# EasyEDA Pro project ProPrj_Project_PRISM_2026-03-07.epro, board PRISM RP2040 260307
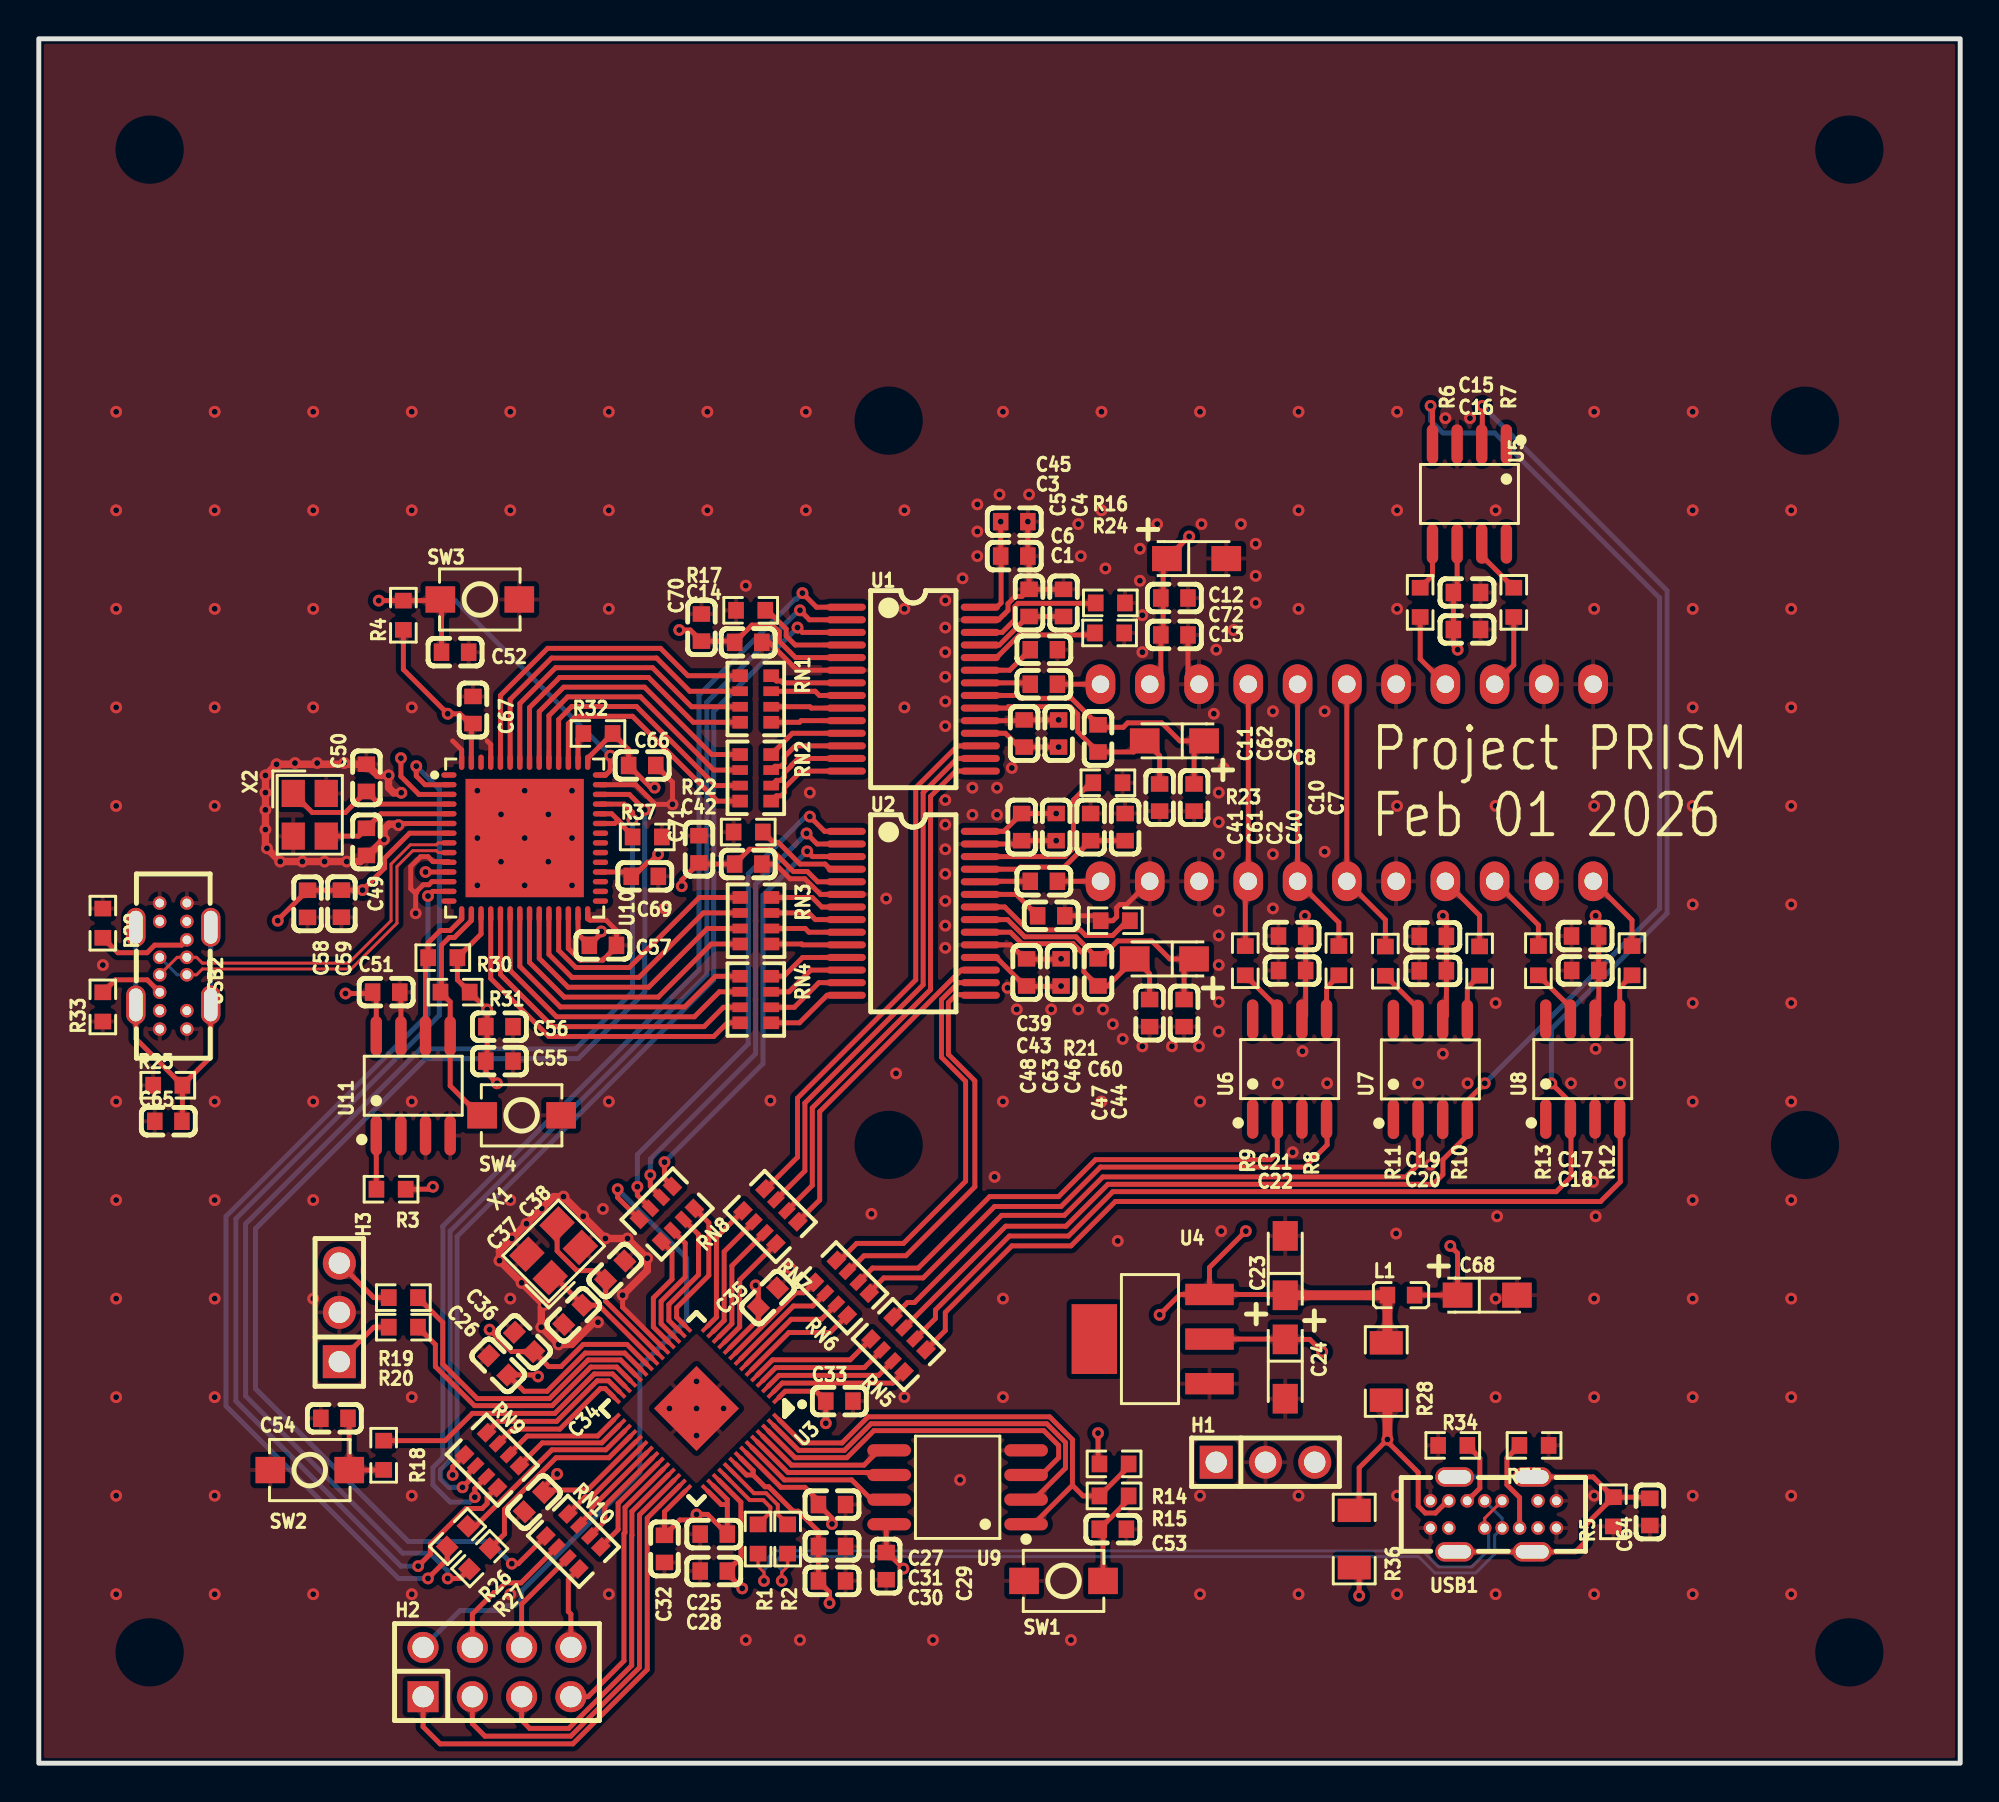
[diagram p4: board, top side]
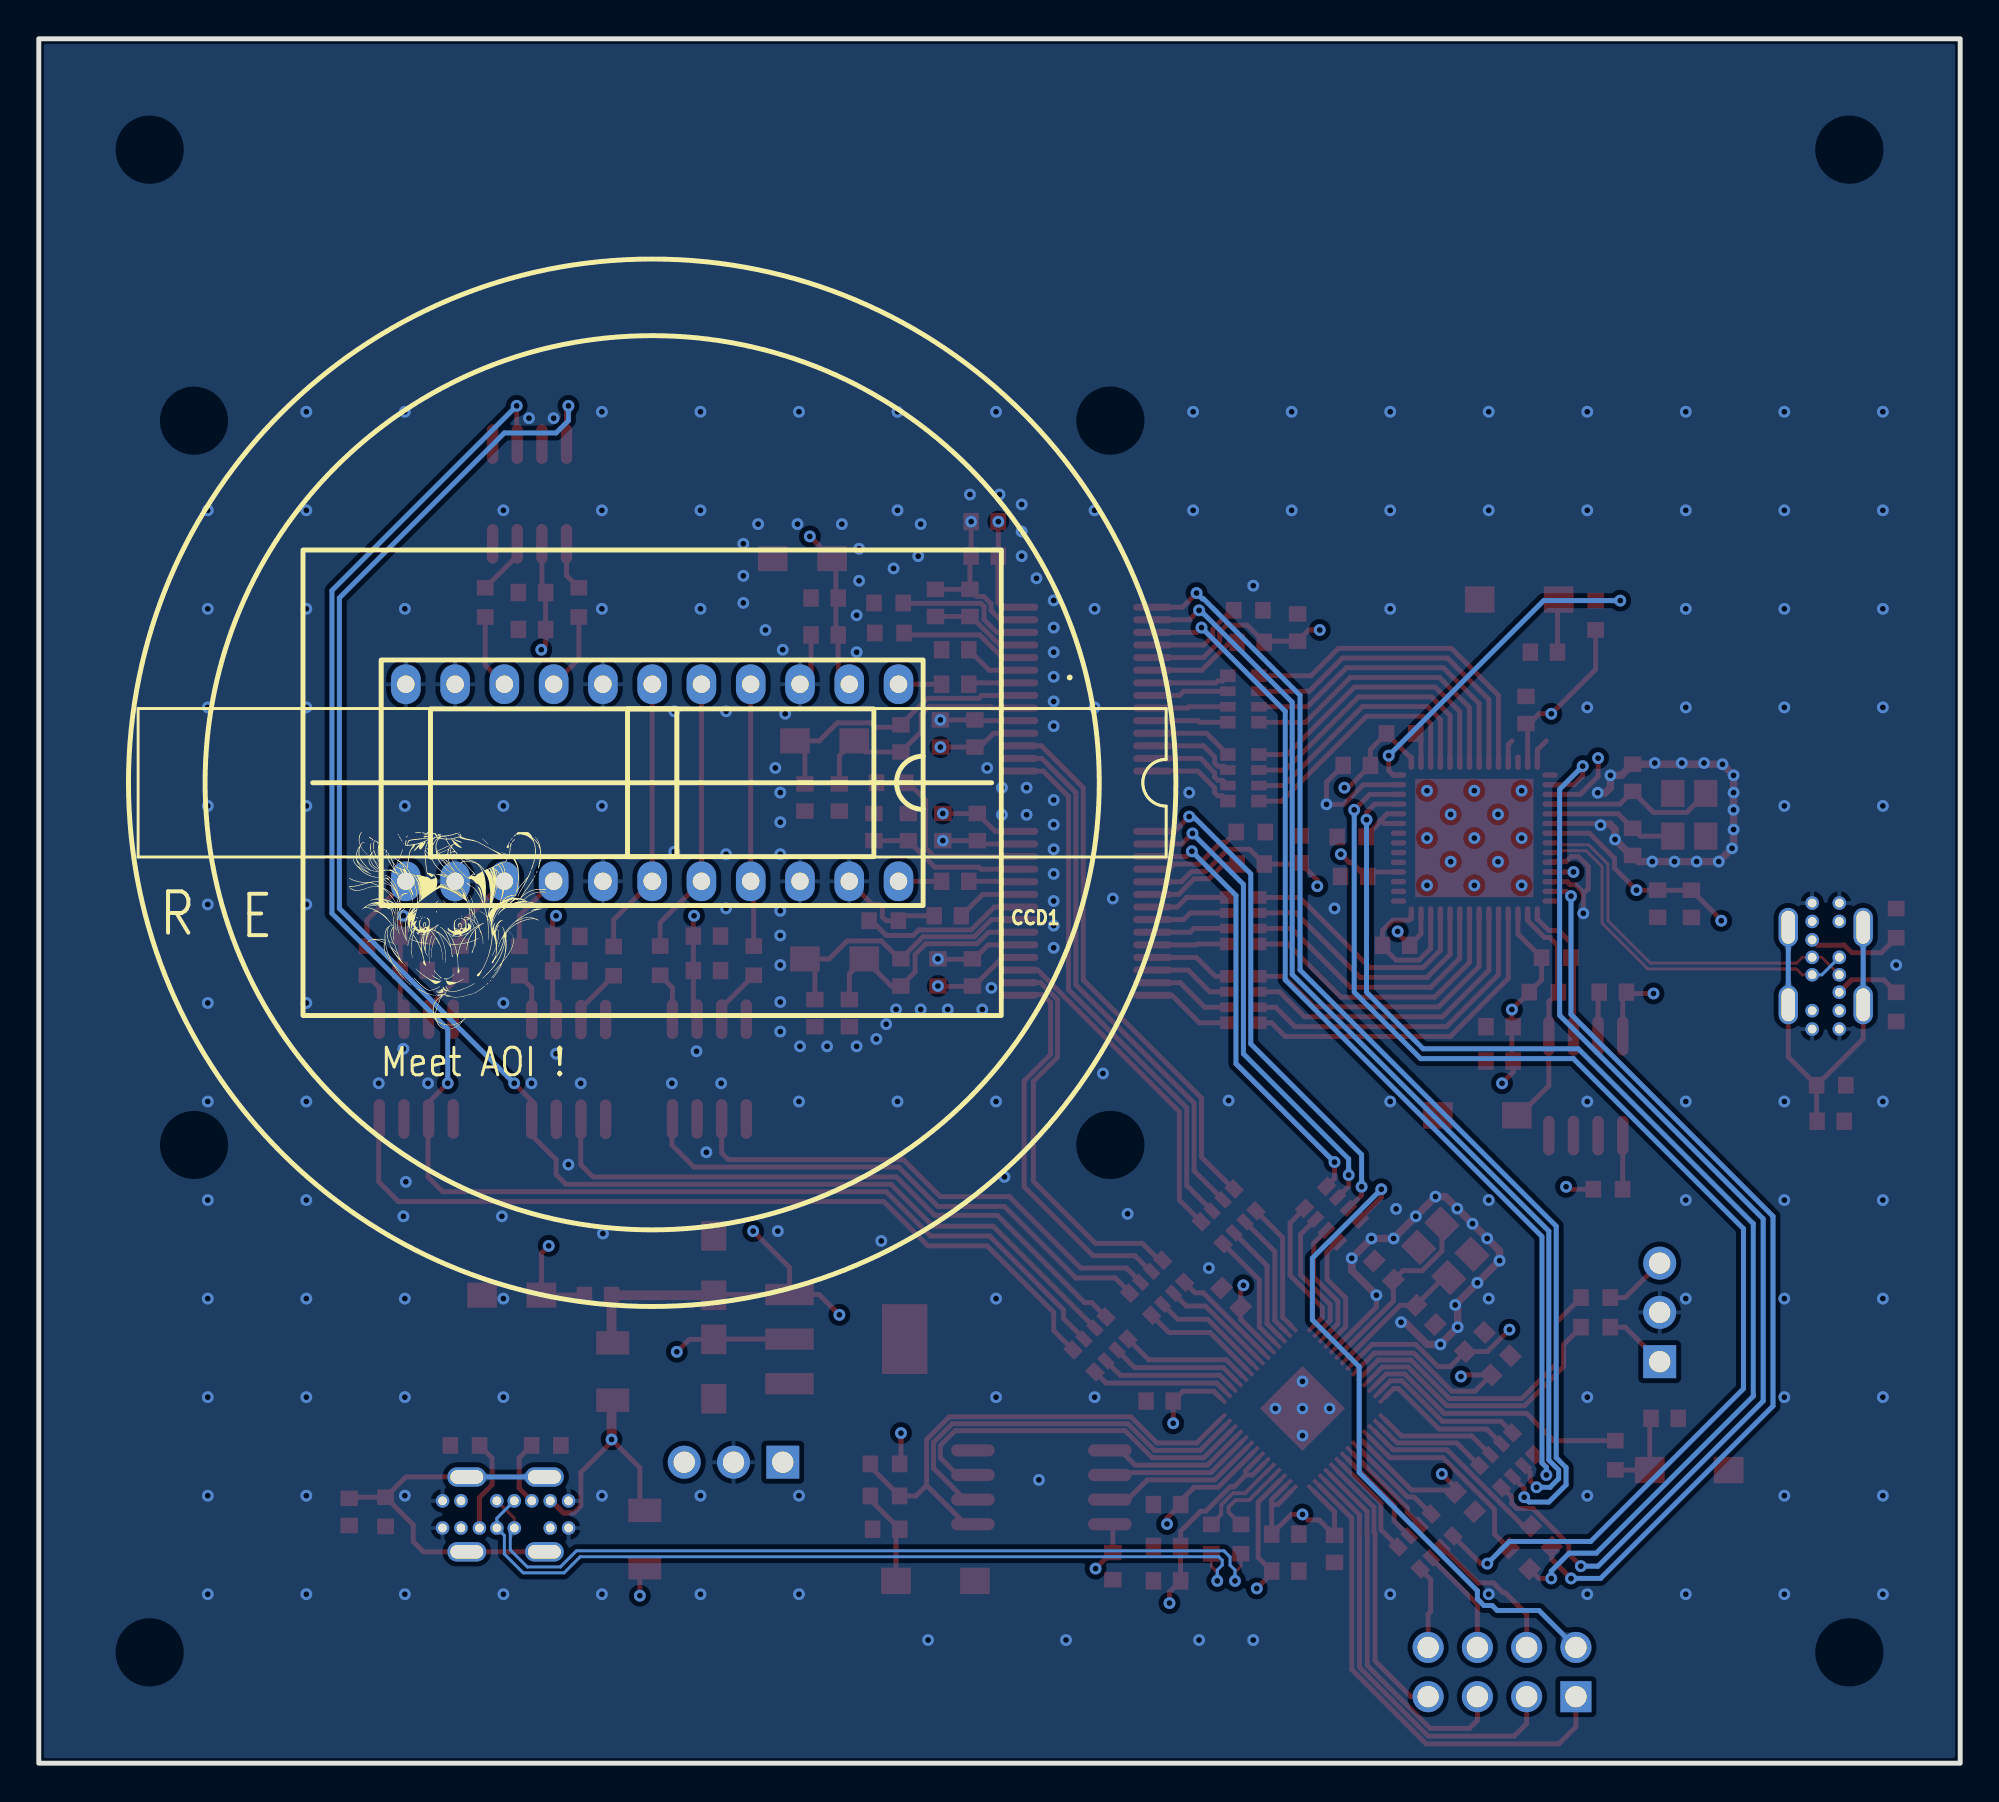
[diagram p5: board, bottom side, seen from below]

Outline 99.06 x 88.9 mm; copper layers: Top Layer, Inner1, Inner2, Bottom Layer. Coordinates in mm from the lower left corner of the outline.
Outline path: rectangle 0,88.9 99.06,0
Stack: Top Layer 0.035mm Outer layer thickness 1oz / Dielectric1 0.2104mm 7628 RC49% 8.6mil / Inner1 0.0152mm Inner layer thickness / Dielectric2 1.065mm 1.1mm H/HOZ Copper / Inner2 0.0152mm Inner layer thickness / Dielectric3 0.2104mm 7628 RC49% 8.6mil / Bottom Layer 0.035mm Outer layer thickness 1oz

## Design rules (mm)
net $2N75: RPI_USB_R
net $2N73: RPI_USB_R
net RPI_USB_DM: RPI_USB
net RPI_USB_DP: RPI_USB
net FIFO_USB_DP: FIFO_USB
net FIFO_USB_DM: FIFO_USB
spacing copperThickness1oz (default): track to track 0.102, other pairs 0.152 to 0.3
spacing copperThickness2oz: track to track 0.203, other pairs 0.152 to 0.3
track width copperThickness1oz (default): min 0.127, default 0.254, max 2.54
track width copperThickness2oz: min 0.203, default 0.254, max 2.54
differential pair differentialPair (default): width min 0.127, default 0.254, max 2.54; gap min 0.152, default 0.152

## Placement (name value [footprint] x y rotation side)
C1  100nF  [C0603]  51.82 55.63 0 top
C2  100nF  [C0603]  54.23 48.26 270 top
C3  100nF  [C0603]  50.29 62.23 180 top
C4  100nF  [C0603]  52.83 59.82 270 top
C5  1uF  [C0603]  51.05 59.82 270 top
C6  100nF  [C0603]  51.82 57.4 0 top
C7  100nF  [C0603]  59.56 49.78 270 top
C8  10uF  [CAP-SMD_L3.2-W1.6-RD-C7171]  58.55 52.71 180 top
C9  100nF  [C0603]  54.61 52.83 90 top
C10  100nF  [C0603]  57.78 49.78 270 top
C11  100nF  [C0603]  50.8 53.09 90 top
C12  10uF  [CAP-SMD_L3.2-W1.6-RD-C7171]  59.69 62.1 0 top
C13  100nF  [C0603]  58.55 58.17 180 top
C14  100nF  [C0603]  36.58 57.79 180 top
C15  1uF  [C0603]  73.63 58.45 180 top
C16  100nF  [C0603]  73.63 60.35 180 top
C17  1uF  [C0603]  79.72 42.64 0 top
C18  100nF  [C0603]  79.73 40.87 0 top
C19  1uF  [C0603]  71.87 42.63 0 top
C20  100nF  [C0603]  71.87 40.85 0 top
C21  1uF  [C0603]  64.61 42.64 0 top
C22  100nF  [C0603]  64.61 40.87 0 top
C23  10uF  [CAP-SMD_L3.2-W1.6-RD-C7171]  64.26 25.65 90 top
C24  10uF  [CAP-SMD_L3.2-W1.6-RD-C7171]  64.26 20.32 270 top
C25  1uF  [C0603]  34.8 11.81 180 top
C26  100nF  [C0603]  23.69 20.51 135 top
C27  100nF  [C0603]  40.89 13.34 0 top
C28  1uF  [C0603]  34.8 9.91 180 top
C29  100nF  [C0603]  43.69 10.16 270 top
C30  100nF  [C0603]  40.89 9.4 0 top
C31  100nF  [C0603]  40.89 11.18 0 top
C32  100nF  [C0603]  32.26 11.05 270 top
C33  100nF  [C0603]  41.28 18.67 0 top
C34  100nF  [C0603]  25.53 13.46 225 top
C35  100nF  [C0603]  37.59 24 45 top
C36  100nF  [C0603]  25.02 21.72 135 top
C37  12pF  [C0603]  27.56 23.11 45 top
C38  12pF  [C0603]  29.72 25.4 225 top
C39  100nF  [C0603]  51.82 45.47 0 top
C40  1uF  [C0603]  56.01 48.26 270 top
C41  100nF  [C0603]  50.67 48.26 90 top
C42  100nF  [C0603]  36.58 46.36 180 top
C43  100nF  [C0603]  52.2 43.69 0 top
C44  100nF  [C0603]  59.05 38.67 270 top
C45  1uF  [C0603]  50.29 64.01 180 top
C46  100nF  [C0603]  54.61 40.77 90 top
C47  100nF  [C0603]  57.27 38.67 270 top
C48  100nF  [C0603]  50.93 40.77 90 top
C49  12pF  [C0603]  16.89 47.5 90 top
C50  12pF  [C0603]  16.89 50.8 270 top
C51  100nF  [C0603]  17.91 39.75 180 top
C52  1uF  [C0603]  21.46 57.28 0 top
C53  1uF  [C0603]  55.37 12.06 180 top
C54  DNF  [C0603]  15.24 17.78 0 top
C55  1uF  [C0603]  23.75 36.2 180 top
C56  100nF  [C0603]  23.75 37.97 180 top
C57  100nF  [C0603]  29.08 42.16 180 top
C58  2.2uF  [C0603]  13.85 44.3 270 top
C59  100nF  [C0603]  15.6 44.31 270 top
C60  10uF  [CAP-SMD_L3.2-W1.6-RD-C7171]  58.03 41.46 180 top
C61  1uF  [C0603]  52.45 48.26 90 top
C62  1uF  [C0603]  52.58 53.09 90 top
C63  1uF  [C0603]  52.71 40.77 90 top
C64  100nF  [C0603]  83.06 12.95 270 top
C65  100nF  [C0603]  6.68 33.09 180 top
C66  100nF  [C0603]  31.11 51.44 180 top
C67  100nF  [C0603]  22.39 54.3 270 top
C68  10uF  [CAP-SMD_L3.2-W1.6-RD-C7171]  74.68 24.13 0 top
C69  100nF  [C0603]  31.24 45.72 180 top
C70  1uF  [C0603]  34.16 58.55 270 top
C71  1uF  [C0603]  34.04 47.12 270 top
C72  1uF  [C0603]  58.55 60.07 180 top
CCD1  -  [CDIP-22_L53.0-W9.7-P2.54-LS10.2-BL]  67.44 50.55 0 bottom
H1  -  [HDR-TH_3P-P2.54-V-M]  63.24 15.52 0 top
H2  -  [HDR-TH_8P-P2.54-V-F-R2-C4-S2.54-1]  23.62 4.7 0 top
H3  -  [HDR-TH_3P-P2.54-V-M]  15.49 23.24 90 top
L1  BLM18PG121SN1D  [L0603]  70.23 24.13 0 top
R1  27R  [R0603]  37.08 11.56 270 top
R2  27R  [R0603]  38.61 11.56 270 top
R3  10K  [R0603]  18.16 29.59 180 top
R4  10K  [R0603]  18.8 59.18 90 top
R5  10K  [R0603]  81.18 12.96 270 top
R6  27R  [R0603]  71.22 59.85 90 top
R7  27R  [R0603]  76.04 59.85 90 top
R8  47R  [R0603]  67.03 41.37 270 top
R9  47R  [R0603]  62.2 41.37 270 top
R10  27R  [R0603]  74.28 41.36 270 top
R11  47R  [R0603]  69.42 41.35 270 top
R12  47R  [R0603]  82.14 41.37 270 top
R13  27R  [R0603]  77.31 41.37 270 top
R14  DNF  [R0603]  55.44 15.43 180 top
R15  10K  [R0603]  55.44 13.78 180 top
R16  0R  [R0603]  55.25 59.82 180 top
R17  0R  [R0603]  36.7 59.44 180 top
R18  10K  [R0603]  17.78 15.88 90 top
R19  100R  [R0603]  18.8 24 0 top
R20  100R  [R0603]  18.8 22.48 0 top
R21  0R  [R0603]  55.5 43.43 0 top
R22  0R  [R0603]  36.58 48.01 180 top
R23  0R  [R0603]  55.12 50.55 180 top
R24  0R  [R0603]  55.21 58.27 180 top
R25  10K  [R0603]  6.65 34.95 180 top
R26  27R  [R0603]  21.59 11.68 225 top
R27  27R  [R0603]  22.73 10.54 225 top
R28  0R  [R1206]  69.47 20.19 90 top
R29  5.1K  [R0603]  3.3 43.31 90 top
R30  2.2K  [R0603]  20.83 41.53 0 top
R31  2.2K  [R0603]  21.46 39.75 0 top
R32  10K  [R0603]  28.83 53.09 180 top
R33  5.1K  [R0603]  3.3 38.99 90 top
R34  5.1K  [R0603]  72.9 16.38 180 top
R35  5.1K  [R0603]  77.09 16.38 0 top
R36  0R  [R1206]  67.82 11.56 270 top
R37  10K  [R0603]  31.37 47.75 0 top
RN1  27Ω  [RES-ARRAY-SMD_0603-8P-L3.2-W1.6-BL]  36.96 54.86 270 top
RN2  27Ω  [RES-ARRAY-SMD_0603-8P-L3.2-W1.6-BL]  36.96 50.8 270 top
RN3  27Ω  [RES-ARRAY-SMD_0603-8P-L3.2-W1.6-BL]  36.97 43.43 270 top
RN4  27Ω  [RES-ARRAY-SMD_0603-8P-L3.2-W1.6-BL]  36.96 39.37 270 top
RN5  27Ω  [RES-ARRAY-SMD_0603-8P-L3.2-W1.6-BL]  44.32 21.59 135 top
RN6  27Ω  [RES-ARRAY-SMD_0603-8P-L3.2-W1.6-BL]  41.4 24.51 135 top
RN7  27Ω  [RES-ARRAY-SMD_0603-8P-L3.2-W1.6-BL]  37.72 28.19 135 top
RN8  27Ω  [RES-ARRAY-SMD_0603-8P-L3.2-W1.6-BL]  32.38 28.32 225 top
RN9  27Ω  [RES-ARRAY-SMD_0603-8P-L3.2-W1.6-BL]  23.37 15.62 315 top
RN10  27Ω  [RES-ARRAY-SMD_0603-8P-L3.2-W1.6-BL]  27.56 11.43 315 top
SW1  -  [Key_SMD_3x4x2]  52.83 9.4 0 top
SW2  -  [Key_SMD_3x4x2]  13.97 15.11 0 top
SW3  -  [Key_SMD_3x4x2]  22.74 60 0 top
SW4  -  [Key_SMD_3x4x2]  24.89 33.4 180 top
U1  AD9826KRSZRL  [SSOP-28_L10.2-W5.3-P0.65-LS7.8-BL]  45.09 55.37 270 top
U2  AD9826KRSZRL  [SSOP-28_L10.2-W5.3-P0.65-LS7.8-BL]  45.09 43.82 270 top
U3  RP2040  [LQFN-56_L7.0-W7.0-P0.4-EP]  33.91 18.29 225 top
U4  AMS1117-3.3  [SOT-223-3_L6.5-W3.4-P2.30-LS7.0-BR]  57.39 21.87 0 top
U5  UCC27524ADR  [SOIC-8_L4.9-W3.9-P1.27-LS6.0-BL]  73.76 65.43 180 top
U6  UCC27524ADR  [SOIC-8_L4.9-W3.9-P1.27-LS6.0-BL]  64.49 35.79 0 top
U7  UCC27524ADR  [SOIC-8_L4.9-W3.9-P1.27-LS6.0-BL]  71.74 35.77 0 top
U8  UCC27524ADR  [SOIC-8_L4.9-W3.9-P1.27-LS6.0-BL]  79.6 35.78 0 top
U9  W25Q128JVSIQ  [SOIC-8_L5.3-W5.3-P1.27-LS8.0-BL]  47.37 14.22 90 top
U10  CY7C68013A-56LTXC  [QFN-56_L8.0-W8.0-P0.50-BL-EP6.1]  25.05 47.7 270 top
U11  CAT24C256WI-GT3  [SOIC-8_L4.9-W3.9-P1.27-LS6.0-BL]  19.3 34.93 0 top
USB1  TYPE-C 14PLC-H10.0  [USB-C-TH_SHOUHAN_TYPE-C-14PLC-H10.0]  74.99 12.83 0 top
USB2  TYPE-C 14PLC-H10.0  [USB-C-TH_SHOUHAN_TYPE-C-14PLC-H10.0]  6.93 41.1 270 top
X1  12MHz  [CRYSTAL-SMD_4P-L3.2-W2.5-BL]  26.54 26.42 45 top
X2  24MHz  [CRYSTAL-SMD_4P-L3.2-W2.5-BL]  13.97 48.9 270 top

## Footprints (pads in the part's own frame, mm; a bottom-side part is the same pattern mirrored in y, then rotated)
C0603
  rect 0.8x0.9 smd: 1(-0.7,0) 2(0.7,0)
CAP-SMD_L3.2-W1.6-RD-C7171
  rect 1.53x1.296 smd: 1(-1.53,0) 2(1.53,0)
CDIP-22_L53.0-W9.7-P2.54-LS10.2-BL
  oval 1.524x2.05 hole 0.9: 1(-12.7,-5.08) 2(-10.16,-5.08) 3(-7.62,-5.08) 4(-5.08,-5.08) 5(-2.54,-5.08) 6(0,-5.08) 7(2.54,-5.08) 8(5.08,-5.08) 9(7.62,-5.08) 10(10.16,-5.08) 11(12.7,-5.08) 12(12.7,5.08) 13(10.16,5.08) 14(7.62,5.08) 15(5.08,5.08) 16(2.54,5.08) 17(0,5.08) 18(-2.54,5.08) 19(-5.08,5.08) 20(-7.62,5.08) 21(-10.16,5.08) 22(-12.7,5.08)
CRYSTAL-SMD_4P-L3.2-W2.5-BL
  rect 1.4x1.2 smd: 1(-1.1,-0.85) 2(1.1,-0.85) 3(1.1,0.85) 4(-1.1,0.85)
HDR-TH_3P-P2.54-V-M
  rect 1.7x1.7 hole 1.1: 1(-2.54,0)
  round 1.7 hole 1.1: 2(0,0) 3(2.54,0)
HDR-TH_8P-P2.54-V-F-R2-C4-S2.54-1
  rect 1.6x1.6 hole 1.1: 1(-3.81,-1.27)
  round 1.6 hole 1.1: 2(-3.81,1.27) 3(-1.27,-1.27) 4(-1.27,1.27) 5(1.27,-1.27) 6(1.27,1.27) 7(3.81,-1.27) 8(3.81,1.27)
Key_SMD_3x4x2
  rect 1.53x1.36 smd: 1(-2.035,0) 2(2.035,0)
L0603
  rect 0.8x0.864 smd: 1(-0.7,0) 2(0.7,0)
LQFN-56_L7.0-W7.0-P0.4-EP
  rect 0.85x0.2 smd: 1(-3.425,2.6) 2(-3.425,2.2) 3(-3.425,1.8) 4(-3.425,1.4) 5(-3.425,1) 6(-3.425,0.6) 7(-3.425,0.2) 8(-3.425,-0.2) 9(-3.425,-0.6) 10(-3.425,-1) 11(-3.425,-1.4) 12(-3.425,-1.8) 13(-3.425,-2.2) 14(-3.425,-2.6) 29(3.425,-2.6) 30(3.425,-2.2) 31(3.425,-1.8) 32(3.425,-1.4) 33(3.425,-1) 34(3.425,-0.6) 35(3.425,-0.2) 36(3.425,0.2) 37(3.425,0.6) 38(3.425,1) 39(3.425,1.4) 40(3.425,1.8) 41(3.425,2.2) 42(3.425,2.6)
  rect 0.2x0.85 smd: 15(-2.6,-3.425) 16(-2.2,-3.425) 17(-1.8,-3.425) 18(-1.4,-3.425) 19(-1,-3.425) 20(-0.6,-3.425) 21(-0.2,-3.425) 22(0.2,-3.425) 23(0.6,-3.425) 24(1,-3.425) 25(1.4,-3.425) 26(1.8,-3.425) 27(2.2,-3.425) 28(2.6,-3.425) 43(2.6,3.425) 44(2.2,3.425) 45(1.8,3.425) 46(1.4,3.425) 47(1,3.425) 48(0.6,3.425) 49(0.2,3.425) 50(-0.2,3.425) 51(-0.6,3.425) 52(-1,3.425) 53(-1.4,3.425) 54(-1.8,3.425) 55(-2.2,3.425) 56(-2.6,3.425)
  rect 3.1x3.1 smd: 57(0,0)
QFN-56_L8.0-W8.0-P0.50-BL-EP6.1
  oval 0.28x0.79 smd: 1(-3.25,-3.908) 2(-2.75,-3.908) 3(-2.25,-3.908) 4(-1.75,-3.908) 5(-1.25,-3.908) 6(-0.75,-3.908) 7(-0.25,-3.908) 8(0.25,-3.908) 9(0.75,-3.908) 10(1.25,-3.908) 11(1.75,-3.908) 12(2.25,-3.908) 13(2.75,-3.908) 14(3.25,-3.908) 29(3.25,3.908) 30(2.75,3.908) 31(2.25,3.908) 32(1.75,3.908) 33(1.25,3.908) 34(0.75,3.908) 35(0.25,3.908) 36(-0.25,3.908) 37(-0.75,3.908) 38(-1.25,3.908) 39(-1.75,3.908) 40(-2.25,3.908) 41(-2.75,3.908) 42(-3.25,3.908)
  oval 0.79x0.28 smd: 15(3.908,-3.25) 16(3.908,-2.75) 17(3.908,-2.25) 18(3.908,-1.75) 19(3.908,-1.25) 20(3.908,-0.75) 21(3.908,-0.25) 22(3.908,0.25) 23(3.908,0.75) 24(3.908,1.25) 25(3.908,1.75) 26(3.908,2.25) 27(3.908,2.75) 28(3.908,3.25) 43(-3.908,3.25) 44(-3.908,2.75) 45(-3.908,2.25) 46(-3.908,1.75) 47(-3.908,1.25) 48(-3.908,0.75) 49(-3.908,0.25) 50(-3.908,-0.25) 51(-3.908,-0.75) 52(-3.908,-1.25) 53(-3.908,-1.75) 54(-3.908,-2.25) 55(-3.908,-2.75) 56(-3.908,-3.25)
  rect 6.1x6.1 smd: 57(0,0)
R0603
  rect 0.806x0.864 smd: 1(-0.753,0) 2(0.753,0)
R1206
  rect 1.208x1.701 smd: 1(-1.479,0) 2(1.479,0)
RES-ARRAY-SMD_0603-8P-L3.2-W1.6-BL
  rect 0.65x0.8 smd: 1(-1.2,-0.8) 4(1.2,-0.8) 5(1.2,0.8) 8(-1.2,0.8)
  rect 0.5x0.8 smd: 2(-0.4,-0.8) 3(0.4,-0.8) 6(0.4,0.8) 7(-0.4,0.8)
SOIC-8_L4.9-W3.9-P1.27-LS6.0-BL
  oval 0.588x2.045 smd: 1(-1.905,-2.57) 2(-0.635,-2.57) 3(0.635,-2.57) 4(1.905,-2.57) 5(1.905,2.57) 6(0.635,2.57) 7(-0.635,2.57) 8(-1.905,2.57)
SOIC-8_L5.3-W5.3-P1.27-LS8.0-BL
  oval 0.63x2.25 smd: 1(-1.905,-3.53) 2(-0.635,-3.53) 3(0.635,-3.53) 4(1.905,-3.53) 5(1.905,3.53) 6(0.635,3.53) 7(-0.635,3.53) 8(-1.905,3.53)
SOT-223-3_L6.5-W3.4-P2.30-LS7.0-BR
  rect 2.5x1.1 smd: 1(2.97,-2.3) 2(2.97,0) 3(2.97,2.3)
  rect 2.34x3.6 smd: 4(-2.97,0)
SSOP-28_L10.2-W5.3-P0.65-LS7.8-BL
  oval 0.364x2.015 smd: 1(-4.225,-3.455) 2(-3.575,-3.455) 3(-2.925,-3.455) 4(-2.275,-3.455) 5(-1.625,-3.455) 6(-0.975,-3.455) 7(-0.325,-3.455) 8(0.325,-3.455) 9(0.975,-3.455) 10(1.625,-3.455) 11(2.275,-3.455) 12(2.925,-3.455) 13(3.575,-3.455) 14(4.225,-3.455) 15(4.225,3.455) 16(3.575,3.455) 17(2.925,3.455) 18(2.275,3.455) 19(1.625,3.455) 20(0.975,3.455) 21(0.325,3.455) 22(-0.325,3.455) 23(-0.975,3.455) 24(-1.625,3.455) 25(-2.275,3.455) 26(-2.925,3.455) 27(-3.575,3.455) 28(-4.225,3.455)
USB-C-TH_SHOUHAN_TYPE-C-14PLC-H10.0
  oval 2x1 hole 1.7x0.7: 0(-2,1.93) 0(-2,-1.93) 0(2,1.93) 0(2,-1.93)
  round 0.7 hole 0.45: A1(-3.25,0.7) A4(-2.3,0.7) A5(-1.35,0.7) A6(-0.45,0.7) A7(0.45,0.7) A9(2.3,0.7) A12(3.25,0.7) B1(3.25,-0.7) B4(2.3,-0.7) B5(1.35,-0.7) B6(0.45,-0.7) B7(-0.45,-0.7) B9(-2.3,-0.7) B12(-3.25,-0.7)

## Nets
As in the schematic, except:
$1N190: R17.1 U1.4
$1N248: R22.1 U2.4
$3N44: R31.1 SW4.2 U10.16 U11.5
$3N81: R3.2 U11.1

Pads without a net: U4 4; U5 1 8; U6 1 8; U7 1 8; U8 1 8; U10 1 29 30 31 33 34 35 36 54 57

## Via types
v1: diameter 0.61, hole 0.305, Top Layer to Bottom Layer, 339 vias

## Routing (per net, layer and track width the routed paths; a pad name or vN(x,y) marks a point on that pad's centre or on a via; arc(x,y) is an arc through that point)
3V3: length 351.8
  Top Layer w0.254: U3.49 36.83,15.08 36.83,14.86 ; v1(31.75,50.29) 31.55,50.29 C66.2 30.41,52.26 R32.1 28.3,51.8 U10.43 ; v1(20.32,29.72) 20.19,29.59 R3.1 ; v1(23.62,35.05) 23.05,35.62 C55.2 ; v1(40.77,8.25) 40.77,8.83 C30.1 C31.1 40.19,11.95 39.16,12.99 38.89,12.99 37.64,14.25 37.44,14.25 36.83,14.86 ; v1(23.24,22.35) 24.37,21.22 C36.1 26.29,20.45 26.92,20.45 28.07,21.59 30.32,21.59 U3.22 ; U3.44 35.5,13.59 35.5,13.34 ; R4.1 18.8,56.39 v1(21.08,54.1) 21.71,54.1 22.3,53.51 ; U10.55 22.3,53.51 ; 22.3,53.51 C67.2 ; v1(33.02,58.42) 33.59,58.42 C70.2 35.81,57.85 C14.2 36.76,58.67 37.82,58.67 38.18,58.32 38.18,57.84 39.01,57 U1.5 ; v1(66.17,21.21) 65.53,21.85 C24.1 64.25,21.87 U4.2 ; 36.83,14.86 36.49,14.86 U3.48 ; v1(40.57,17.53) C33.1 40.07,19.18 38.48,19.18 38.18,18.87 38.17,18.87 ; U3.10 37.1,22.89 37.1,24.5 v1(36.96,24.64) ; v1(33.15,45.21) 33.15,45.53 C71.2 34.1,46.36 C42.2 36.64,47.12 37.76,47.12 38.9,45.97 39.62,45.97 40.16,45.44 U2.5 ; U10.11 v1(19.94,45.95) ; 23.18,36.2 23.11,36.2 v1(23.11,38.85) R31.2 21.58,40.39 R30.2 22.8,42.75 U10.17 ; v1(31.93,46.86) 31.52,46.45 31.39,46.45 30.89,45.95 U10.32 ; U10.27 27.8,42.75 C57.2 29,42.78 v1(29,42.88) ; U3.33 28.29,14.08 25.89,14.08 v1(26.73,14.91) ; U11.8 17.4,39.56 C51.2 17.14,39.68 v1(15.81,39.68) ; U9.8 43.69,12.17 C29.1 43.75,10.86 v1(44.58,10.03) ; v1(12.32,43.43) 12.32,43.47 C58.1 15.59,45 C59.1 v1(16.69,45.01) 17.82,46.14 17.82,46.65 19.12,47.95 U10.7 ; v1(54.61,17.02) 54.61,15.5 R14.2 ; 35.5,13.34 35.19,13.34 U3.43 ; 35.5,13.34 C25.1 34.48,12.83 v1(33.91,12.83) 33.62,12.54 33.05,12.54 C32.1 32.26,12.96 U3.42 ; v1(18.67,51.82) 18.67,50.87 19.6,49.95 U10.3
  Inner2 w0.508: 14.61,38.48 12.32,40.77 v1(12.32,43.43) ; 14.61,38.48 v1(15.81,39.68) ; 14.61,38.48 18.03,35.05 v1(23.62,35.05) ; 31.24,35.05 45.09,21.21 54.59,21.21 54.61,21.19 ; 31.24,35.05 33.15,36.96 v1(33.15,45.21) 35.31,47.38 35.31,56.13 v1(33.02,58.42) ; 31.24,35.05 26.67,35.05 ; 44.76,16.84 54.43,16.84 ; 44.76,16.84 42.3,19.3 ; 44.76,16.84 43.04,15.12 43.04,10.53 ; v1(23.11,38.85) 23.11,42.77 v1(19.94,45.95) ; 31.96,46.89 31.96,49.44 31.75,49.65 v1(31.75,50.29) 31.75,53.09 30.73,54.1 v1(21.08,54.1) ; 31.96,46.89 31.96,46.82 29,43.86 v1(29,42.88) 26.67,40.55 26.67,35.05 ; 31.96,46.89 v1(31.93,46.86) ; 43.04,10.53 v1(40.77,8.25) 35.18,8.25 33.91,9.53 v1(33.91,12.83) 28.81,12.83 v1(26.73,14.91) 23.24,18.4 v1(23.24,22.35) ; 43.04,10.53 44.08,10.53 v1(44.58,10.03) ; v1(16.69,45.01) 19.4,47.72 19.4,50.32 18.8,50.93 18.8,51.06 18.75,51.11 18.75,51.73 v1(18.67,51.82) ; 26.67,35.05 v1(23.62,35.05) ; 54.61,21.19 54.61,17.15 ; 54.61,21.19 57.68,24.26 63.12,24.26 v1(66.17,21.21) 66.17,15.9 H1.3 ; 42.3,19.3 v1(36.96,24.64) ; 42.3,19.3 40.57,17.57 v1(40.57,17.53) ; v1(23.62,35.05) 23.62,33.02 v1(20.32,29.72)
+5V: length 113.3
  Top Layer w0.254: U8.6 80.43,38.55 C18.2 80.42,40.88 C17.2 80.42,43.53 v1(80.26,43.69) ; U7.6 72.57,38.53 C20.2 C19.2 72.57,43.51 v1(72.39,43.69) ; v1(65.28,43.69) 65.31,43.65 C21.2 C22.2 65.31,38.55 U6.6 ; R28.2 69.6,21.55 ; v1(57.78,23.11) 58.84,24.17 U4.3 ; U5.6 73.12,60.55 C16.2 C15.2 72.93,57.62 v1(73.15,57.4) ; U4.3 60.36,25.56 v1(62.23,27.43) ; U4.3 64.22,24.17 C23.1
  Top Layer w0.508: R28.2 69.53,21.73 L1.1 69.53,24.12 C23.1
  Inner2 w0.508: 77.09,40.51 v1(80.26,43.69) ; 77.09,40.51 77.09,35.81 75.31,34.04 68.83,34.04 ; 77.09,40.51 76.33,41.28 76.33,56.52 75.44,57.4 v1(73.15,57.4) ; 68.83,40.13 v1(72.39,43.69) ; 68.83,40.13 v1(65.28,43.69) ; 68.83,40.13 68.83,34.04 ; v1(57.78,23.11) 57.78,18.44 H1.1 ; v1(62.23,27.43) 68.83,34.04
A5V: length 115.7
  Top Layer w0.254: v1(49.59,64.01) C3.2 49.61,62.21 49.61,59.82 49.39,59.6 U1.28 ; U2.18 49.37,41.54 50.85,40.05 50.85,40.05 52.68,40.05 v1(52.71,40.07) ; U1.18 49.84,53.1 50.55,52.39 v1(52.58,52.39) ; v1(72.77,26.67) 73.15,26.3 C68.1 70.93,24.13 ; v1(52.45,48.96) C41.2 49.75,48.04 U2.28 ; 57.28,55.63 57.85,56.2 C13.2 57.97,58.29 57.97,61.91 C12.1 59.3,63.25 v1(59.31,63.25)
  Inner2 w0.508: 55.94,40.07 v1(52.71,40.07) 51.28,41.5 51.28,47.78 v1(52.45,48.96) 52.45,50.17 51.31,51.31 ; 55.94,40.07 58.55,42.67 58.55,56.64 59.31,57.4 v1(59.31,63.25) ; 55.94,40.07 57.66,38.35 57.66,29.46 60.71,26.42 72.52,26.42 v1(72.77,26.67) ; v1(49.59,64.01) 49.59,53.02 51.31,51.31 ; 51.31,51.31 52.39,52.39 v1(52.58,52.39)
AGND: length 112.6
  Top Layer w0.254: 29.53,42.42 29.53,41.85 29.08,41.4 27.9,41.4 27.3,42 U10.26 ; C5.1 50.69,60.15 50.34,60.15 49.97,59.78 49.97,59.43 49.48,58.95 U1.27 ; C5.1 51.05,62.17 C3.1 v1(50.99,64.01) ; C5.1 C4.1 ; U11.7 18.67,39.69 C51.1 ; U2.19 50.11,42.19 50.85,41.45 52.68,41.45 v1(52.71,41.47) ; v1(18.54,48.36) 18.63,48.45 U10.6 ; U10.28 28.3,43.58 28.42,43.46 29.24,43.46 29.78,42.93 C57.1 ; U10.53 23.3,52.52 23.11,52.71 ; 37.66,57.79 39.09,56.35 41.63,56.35 ; U10.10 21.11,46.48 20.32,46.48 20.07,46.74 19.69,46.74 19.18,46.23 19.18,45.09 19.43,44.83 ; v1(52.58,53.79) 50.55,53.79 50.51,53.75 U1.19 ; v1(30.1,24.13) 30.1,23.51 U3.19 ; 57.28,45.47 56.08,44.27 55.73,44.27 55.57,44.11 55.57,43.63 55.37,43.43 54.87,43.43 54.62,43.69 C43.2 ; 19.43,44.83 19.48,44.88 19.48,44.95 19.82,45.29 20.11,45.29 20.27,45.45 U10.12 ; 19.43,44.83 v1(19.43,43.82) ; v1(52.45,47.56) C41.1 50.5,47.39 U2.27 ; C13.1 59.25,56.2 CCD1.3 ; U10.41 30.77,50.45 31.78,49.44 v1(32.67,49.44) 32.67,50.58 C66.1 ; C42.1 37.97,46.36 38.74,45.59 39.5,45.59 40.3,44.79 U2.6 ; 21.34,52.71 21.8,52.24 U10.56
  Top Layer w0.381: v1(28.83,22.73) 28.62,22.73 27.47,21.59 v1(26.8,21.59) v1(25.91,22.48) 25.91,23.5 v1(26.03,23.62) v1(24.89,24.77) v1(23.75,25.91) 23.75,26.42 v1(24.39,27.06) v1(25.14,27.81) v1(25.93,28.6) 26.54,29.21 v1(27.05,29.21) v1(28.07,28.2) v1(29.21,27.05) v1(30.35,27.05) v1(31.37,26.04) 31.37,25.4 v1(30.1,24.13) ; v1(18.54,48.36) 18.49,48.41 18.06,48.41 17.8,48.15 v1(17.8,47.62) 16.97,46.8 C49.1 16.58,46.48 v1(15.88,46.48) v1(14.73,46.48) v1(13.59,46.48) v1(12.45,46.48) 11.68,47.24 v1(11.68,48.13) v1(11.68,49.15) v1(11.68,50.04) v1(11.68,50.93) v1(12.26,51.5) C50.1 17.46,50.93 v1(18.03,50.93) 18.03,50.29 18.3,50.03 v1(18.69,50.03)
  vias: v1(3.3,41.15) v1(3.99,69.67) v1(3.99,64.59) v1(3.99,59.51) v1(3.99,54.43) v1(3.99,49.35) v1(3.99,34.11) v1(3.99,29.03) v1(3.99,23.95) v1(3.99,18.87) v1(3.99,13.79) v1(3.99,8.71) v1(9.07,69.67) v1(9.07,64.59) v1(9.07,59.51) v1(9.07,54.43) v1(9.07,49.35) v1(9.07,34.11) v1(9.07,29.03) v1(9.07,23.95) v1(9.07,18.87) v1(9.07,13.79) v1(9.07,8.71) v1(11.76,47.17) v1(13.21,51.56) v1(14.15,69.67) v1(14.15,64.59) v1(14.15,59.51) v1(14.15,54.43) v1(14.15,34.11) v1(14.15,29.03) v1(14.15,23.95) v1(14.15,8.71) v1(14.35,51.56) v1(15.75,51.56) v1(19.23,69.67) v1(19.23,64.59) v1(19.23,54.43) v1(19.23,34.11) v1(19.23,18.87) v1(19.23,13.79) v1(19.23,8.71) v1(24.31,69.67) v1(24.31,64.59) v1(24.31,29.03) v1(24.31,23.95) v1(24.31,8.71) v1(29.08,28.58) v1(29.39,69.67) v1(29.39,64.59) v1(29.39,59.51) v1(29.39,34.11) v1(29.39,8.71) v1(32.26,44.07) v1(32.51,18.29) v1(33.91,19.69) v1(33.91,18.29) v1(33.91,16.89) v1(34.47,69.67) v1(34.47,64.59) v1(35.31,18.29) v1(36.45,60.71) v1(36.45,6.35) v1(37.72,34.16) v1(38.74,25.53) v1(39.24,6.35) v1(39.55,69.67) v1(39.55,64.59) v1(39.75,50.04) v1(42.93,28.32) v1(43.69,44.58) v1(44.2,35.56) v1(44.63,64.59) v1(44.63,59.51) v1(44.63,54.43) v1(44.63,18.87) v1(46.1,6.35) v1(46.74,59.94) v1(46.74,58.55) v1(46.74,57.28) v1(46.74,56.01) v1(46.74,54.74) v1(46.74,53.47) v1(46.74,49.66) v1(46.74,48.39) v1(46.74,47.12) v1(46.74,45.85) v1(46.74,44.45) v1(46.74,43.18) v1(46.74,42.04) v1(47.5,14.61) v1(47.62,61.09) v1(48.13,50.29) v1(48.13,48.9) v1(48.39,64.9) v1(48.39,63.5) v1(48.39,62.23) v1(49.28,30.23) v1(49.4,50.29) v1(49.4,48.9) v1(49.53,65.41) v1(49.71,69.67) v1(49.71,34.11) v1(49.71,23.95) v1(49.71,18.87) v1(49.95,39.97) v1(50.16,51.31) v1(50.42,38.86) v1(51.05,65.41) v1(52.2,38.86) v1(53.21,6.35) v1(53.59,63.88) v1(53.59,38.86) v1(53.72,62.23) v1(54.79,69.67) v1(54.79,64.59) v1(54.79,34.11) v1(54.86,38.86) v1(54.99,61.59) v1(55.37,38.1) v1(55.63,26.92) v1(55.88,37.34) v1(56.77,62.61) v1(56.77,60.96) v1(56.9,59.18) v1(56.9,57.28) v1(56.9,36.96) v1(57.66,63.88) v1(58.42,36.96) v1(59.82,36.96) v1(59.87,69.67) v1(59.94,63.88) v1(59.87,34.11) v1(59.87,13.79) v1(59.87,8.71) v1(60.58,54.1) v1(60.71,57.4) v1(60.83,50.04) v1(60.83,48.51) v1(60.83,46.86) v1(60.83,43.94) v1(60.83,42.67) v1(60.83,41.15) v1(60.83,39.24) v1(60.83,37.72) v1(60.96,27.43) v1(61.09,51.31) v1(61.59,58.42) v1(61.98,63.88) v1(62.74,62.87) v1(62.74,61.21) v1(62.74,59.82) v1(63.63,54.23) v1(63.63,46.86) v1(63.63,44.07) v1(63.88,35.05) v1(64.64,31.5) v1(64.95,69.67) v1(64.95,64.59) v1(64.95,59.51) v1(64.95,13.79) v1(64.95,8.71) v1(65.15,36.7) v1(66.29,54.23) v1(66.29,46.99) v1(66.42,35.05) v1(70.03,69.67) v1(70.03,64.59) v1(70.03,59.51) v1(70.03,49.35) v1(69.98,27.31) v1(70.03,13.79) v1(70.03,8.71) v1(71.12,35.05) v1(71.75,30.86) v1(72.39,36.58) v1(72.52,69.34) v1(73.66,35.05) v1(73.79,69.34) v1(75.11,64.59) v1(75.11,49.35) v1(75.11,39.19) v1(75.11,23.95) v1(75.11,18.87) v1(75.11,8.71) v1(75.18,28.19) v1(78.99,35.05) v1(80.14,29.97) v1(80.19,69.67) v1(80.19,59.51) v1(80.19,49.35) v1(80.19,23.95) v1(80.19,18.87) v1(80.19,13.79) v1(80.19,8.71) v1(80.26,36.83) v1(80.26,28.19) v1(81.53,35.05) v1(85.27,69.67) v1(85.27,64.59) v1(85.27,59.51) v1(85.27,54.43) v1(85.27,49.35) v1(85.27,44.27) v1(85.27,39.19) v1(85.27,34.11) v1(85.27,29.03) v1(85.27,23.95) v1(85.27,18.87) v1(85.27,13.79) v1(85.27,8.71) v1(90.35,64.59) v1(90.35,59.51) v1(90.35,54.43) v1(90.35,49.35) v1(90.35,44.27) v1(90.35,39.19) v1(90.35,34.11) v1(90.35,29.03) v1(90.35,23.95) v1(90.35,18.87) v1(90.35,13.79) v1(90.35,8.71)
(no net):
  vias: v1(22.61,50.14) v1(22.61,47.7) v1(22.61,45.26) v1(23.83,48.92) v1(23.83,46.48) v1(25.05,50.14) v1(25.05,47.7) v1(25.05,45.26) v1(26.27,48.92) v1(26.27,46.48) v1(27.49,50.14) v1(27.49,47.7) v1(27.49,45.26)
ADC1_ADCCLK: length 55
  Top Layer w0.254: RN9.1 21.34,15.29 v1(21.34,14.86) ; v1(39.12,58.55) 39.37,58.3 U1.3
  Bottom Layer w0.254: v1(21.34,14.86) 21.34,15.25 21.56,15.48 21.56,27.15 34.8,40.39 34.8,54.23 v1(39.12,58.55)
ADC1_CAPB: length 12.8
  Top Layer w0.254: C10.1 57.78,51.94 C8.2 56.44,52.13 C9.1 53.57,53.18 53.57,54.07 53.17,54.47 49.98,54.47 49.91,54.4 U1.20
ADC1_CAPT: length 15.1
  Top Layer w0.254: C7.1 59.56,52.19 C8.1 58.82,52.71 57.9,53.63 56.14,53.63 55.91,53.41 54.74,53.41 53.25,54.9 50.6,54.9 50.45,55.05 48.54,55.05
ADC1_CDSCLK1: length 60.4
  Top Layer w0.254: 23.08,14.77 22.48,14.17 v1(22.48,13.72) ; v1(39.37,60.33) 40.1,59.6 U1.1
  Bottom Layer w0.254: v1(22.48,13.72) 22.22,13.46 21.21,13.46 20.32,14.35 20.32,15.24 20.83,15.75 20.83,27.69 34.04,40.89 34.04,55.06 39,60.02 39.06,60.02 v1(39.37,60.33)
ADC1_CDSCLK2: length 57.8
  Top Layer w0.254: RN9.2 22.17,14.99 22.17,14.55 v1(21.84,14.22) ; U1.2 39.73,58.95 v1(39.24,59.44)
  Bottom Layer w0.254: v1(21.84,14.22) 21.14,14.22 20.7,14.67 20.7,15.12 21.21,15.63 21.21,27.43 34.44,40.67 34.44,54.7 39.18,59.44 v1(39.24,59.44)
ADC1_CML: length 3
  Top Layer w0.254: C6.1 50.06,56.35 48.54,56.35
ADC1_D0: length 12.8
  Top Layer w0.254: RN2.4 34.98,49.6 30.61,53.98 27.68,53.98 27.3,53.59 U10.45
ADC1_D1: length 13.5
  Top Layer w0.254: RN2.3 34.89,50.4 30.81,54.48 27.47,54.48 26.8,53.8 U10.46
ADC1_D2: length 14.2
  Top Layer w0.254: RN2.2 34.8,51.2 31.02,54.98 27.27,54.98 26.3,54.01 U10.47
ADC1_D3: length 14.9
  Top Layer w0.254: RN2.1 34.7,52 31.23,55.48 27.06,55.48 25.8,54.22 U10.48
ADC1_D4: length 15.3
  Top Layer w0.254: U10.49 25.3,54.42 26.85,55.98 31.44,55.98 33.75,53.66 RN1.4
ADC1_D5: length 16
  Top Layer w0.254: RN1.3 33.65,54.46 31.64,56.48 26.65,56.48 24.8,54.63 U10.50
ADC1_D6: length 16.7
  Top Layer w0.254: U10.51 24.3,54.84 26.44,56.98 31.85,56.98 33.56,55.26 RN1.2
ADC1_D7: length 17.4
  Top Layer w0.254: U10.52 23.8,55.04 26.23,57.48 32.06,57.48 33.47,56.06 RN1.1
ADC1_OFFSET: length 4.9
  Top Layer w0.254: C4.2 C5.2 50.99,59.12 49.52,57.65 U1.25
ADC1_SCLK: length 27.8
  Top Layer w0.254: RN7.3 39.5,30.54 39.5,34.04 45.59,40.13 45.59,50.04 47.35,51.8 U1.16
ADC1_SDATA: length 27.5
  Top Layer w0.254: RN7.2 39.88,29.79 39.88,33.78 45.97,39.88 45.97,49.84 47.28,51.15 U1.15
ADC1_SLOAD: length 28.2
  Top Layer w0.254: U1.17 47.37,52.45 45.21,50.29 45.21,40.39 39.12,34.29 39.12,31.24 37.48,29.61 RN7.4
ADC2_ADCCLK: length 22.6
  Top Layer w0.254: RN8.1 32.26,30.15 v1(32.26,30.99) ; U2.3 39.89,46.74 v1(39.61,47.01)
  Bottom Layer w0.254: v1(32.26,30.99) 37.34,36.07 37.34,44.74 v1(39.61,47.01)
ADC2_CAPB: length 12.6
  Top Layer w0.254: C47.1 57.27,40.7 C60.2 55.1,40.07 C46.1 53.88,40.8 53.88,41.69 53.33,42.25 50.69,42.25 50.09,42.84 U2.20
ADC2_CAPT: length 14.9
  Top Layer w0.254: U2.21 49.95,43.49 50.83,42.6 53.47,42.6 C46.2 54.7,41.47 55.62,42.39 57.38,42.39 58.31,41.46 C60.1 59.05,40.95 C44.1
ADC2_CDSCLK1: length 26.5
  Top Layer w0.254: v1(39.75,48.8) 40.51,48.04 U2.1 ; v1(30.86,29.72) 30.86,29.28 RN8.3
  Bottom Layer w0.254: v1(39.75,48.8) 39.53,48.8 36.58,45.85 36.58,37.08 30.86,31.37 v1(30.86,29.72)
ADC2_CDSCLK2: length 24.6
  Top Layer w0.254: U2.2 40.12,47.39 v1(39.58,47.93) ; v1(31.53,30.32) 31.53,29.74 RN8.2
  Bottom Layer w0.254: v1(39.58,47.93) 36.96,45.31 36.96,36.58 31.53,31.15 v1(31.53,30.32)
ADC2_CML: length 3.4
  Top Layer w0.254: U2.23 50.4,44.79 C43.1
ADC2_D0: length 17.7
  Top Layer w0.254: RN4.4 35.5,38.17 34.8,37.47 26.29,37.47 23.3,40.46 U10.18
ADC2_D1: length 17
  Top Layer w0.254: RN4.3 35.3,38.97 34.3,37.97 26.49,37.97 23.8,40.66 U10.19
ADC2_D2: length 16.3
  Top Layer w0.254: U10.20 24.3,40.87 26.69,38.48 33.8,38.48 35.09,39.77 RN4.2
ADC2_D3: length 15.6
  Top Layer w0.254: U10.21 24.8,41.08 26.89,38.99 33.3,38.99 34.88,40.57 RN4.1
ADC2_D4: length 15.2
  Top Layer w0.254: U10.22 25.3,41.29 27.09,39.5 31.94,39.5 34.67,42.23 RN3.4
ADC2_D5: length 14.5
  Top Layer w0.254: RN3.3 34.47,43.03 31.44,40.01 27.29,40.01 25.8,41.49 U10.23
ADC2_D6: length 13.8
  Top Layer w0.254: U10.24 26.3,41.7 27.49,40.51 30.94,40.51 34.26,43.83 RN3.2
ADC2_D7: length 13.1
  Top Layer w0.254: RN3.1 34.05,44.63 30.44,41.02 27.69,41.02 26.8,41.91 U10.25
ADC2_OFFSET: length 8.1
  Top Layer w0.254: U2.25 50.5,46.09 50.6,46.2 52.86,46.2 C2.2 C40.2
ADC2_SCLK: length 20.3
  Top Layer w0.254: U2.16 47.41,40.24 46.54,39.37 46.54,36.4 47.78,35.15 47.78,30 44.58,26.8 42.17,26.8 41.37,26.01
ADC2_SDATA: length 20.3
  Top Layer w0.254: U2.15 48.51,39.62 47.3,39.62 46.89,39.22 46.89,36.55 48.26,35.18 48.26,29.72 44.7,26.16 42.54,26.16 41.74,25.36 RN6.3
ADC2_SLOAD: length 17.5
  Top Layer w0.254: U2.17 47.56,40.89 40.26,33.59 40.26,29.04 39.13,27.91
CCD_1E: length 4.3
  Top Layer w0.254: R13.1 77.31,43.21 75.06,45.47
CCD_1O: length 3.9
  Top Layer w0.254: R7.1 76.04,56.61 75.06,55.63
CCD_2B: length 14.3
  Top Layer w0.254: R11.1 69.42,43.48 CCD1.17 CCD1.6
CCD_2E: length 4.1
  Top Layer w0.254: 74.28,42.11 74.28,43.7 72.52,45.47
CCD_2O: length 4
  Top Layer w0.254: 72.52,55.63 71.22,56.93 R6.1
CCD_CLK_1: length 86.1
  Top Layer w0.254: RN5.2 46.23,22.93 46.23,23.37 50.04,27.18 53.09,27.18 55.37,29.46 78.23,29.46 78.99,30.23 78.99,33.18 U8.2 78.96,34.07 v1(77.98,35.05) ; U5.2 74.42,68.03 v1(74.42,69.98)
  Bottom Layer w0.254: v1(77.98,35.05) 77.98,37.85 83.95,43.82 83.95,60.45 v1(74.42,69.98)
CCD_CLK_2: length 83.8
  Top Layer w0.254: RN5.3 49.85,27.69 52.96,27.69 55.12,29.84 71.88,29.84 72.39,30.35 72.39,31.12 73.65,32.37 U7.4 73.65,34.15 v1(74.55,35.05) ; v1(71.75,69.98) 71.85,69.88 U5.4
  Bottom Layer w0.254: v1(71.75,69.98) 71.75,69.22 72.39,68.58 75.06,68.58 83.57,60.07 83.57,44.07 v1(74.55,35.05)
CCD_CLK_2B: length 32.7
  Top Layer w0.254: RN5.4 44.78,23.75 45.14,23.75 49.64,28.24 52.87,28.24 54.85,30.23 70.49,30.23 71.12,30.86 71.12,33.19 U7.2
CCD_CLK_CP: length 26.1
  Top Layer w0.254: RN6.2 42.98,25.53 45.34,25.53 49.02,29.21 52.58,29.21 54.48,31.12 63.5,31.12 63.85,31.46 U6.2
CCD_CLK_RS: length 28.2
  Top Layer w0.254: RN6.1 42.82,24.27 43.56,25.02 45.59,25.02 49.28,28.7 52.71,28.7 54.74,30.73 65.28,30.73 66.42,31.88 66.42,33.19 U6.4
CCD_CLK_SH: length 43.2
  Top Layer w0.254: 45.74,21.31 46.74,22.31 46.74,23.24 50.16,26.67 53.21,26.67 55.5,28.96 80.52,28.96 81.53,29.97 81.53,33.18 U8.4
CCD_CP: length 13.6
  Top Layer w0.254: R9.1 62.2,45.31 CCD1.19 CCD1.4
CCD_OS1: length 2.2
  Top Layer w0.254: C1.2 54.74,55.63
CCD_OS2: length 2.2
  Top Layer w0.254: C39.2 54.74,45.47
CCD_RS: length 14.4
  Top Layer w0.254: 64.9,55.63 64.9,45.47 67.03,43.34 R8.1
CCD_SH: length 4.2
  Top Layer w0.254: CCD1.12 82.14,43.46 R12.1
FALSH_SCLK: length 7.5
  Top Layer w0.254: U9.6 43.71,14.99 38.62,14.99 U3.52
FIFO_IFCLK: length 47.9
  Top Layer w0.254: R26.2 21.06,10.52 v1(20.06,9.53) ; v1(20.07,44.7) 20.31,44.95 U10.13
  Bottom Layer w0.254: v1(20.07,44.7) 20.07,38.61 9.65,28.19 9.65,18.41 18.54,9.53 v1(20.06,9.53)
FIFO_PKTEND: length 60.7
  Top Layer w0.254: U10.39 30.18,49.45 30.61,49.02 v1(30.61,48.64) ; v1(21.08,9.52) 21.72,9.52 R27.2
  Bottom Layer w0.254: v1(21.08,9.52) 21.08,9.91 20.16,10.83 18.76,10.83 10.67,18.92 10.67,27.81 19.69,36.83 27.69,36.83 30.61,39.75 v1(30.61,48.64)
FIFO_SLCS: length 64.7
  Top Layer w0.254: v1(31.24,49.15) 30.45,49.95 U10.40 ; RN10.1 24.72,10.29 v1(24.38,10.29)
  Bottom Layer w0.254: v1(31.24,49.15) 31.24,39.76 27.81,36.32 19.94,36.32 11.18,27.56 11.18,19.3 19.05,11.43 23.24,11.43 v1(24.38,10.29)
FIFO_SLWR: length 59.1
  Top Layer w0.254: v1(19.56,10.16) 20.19,10.79 20.19,11.29 22.03,13.13 22.86,13.13 23.11,13.39 23.11,13.72 23.6,14.21 23.65,14.21 ; U10.2 19.91,50.45 19.46,50.9 v1(19.46,51.4)
  Bottom Layer w0.254: v1(19.46,51.4) 20.65,50.22 20.65,38.56 10.16,28.07 10.16,18.67 18.67,10.16 v1(19.56,10.16)
FIFO_USB_DM: length 19.7
  Top Layer w0.152: U10.9 20.6,46.95 20.5,47.04 19.28,47.04 18.47,46.23 18.47,43.31 16.1,40.94 8.43,40.94 8.14,40.65 7.63,40.65
  Bottom Layer w0.152: 7.63,40.65 7.13,40.65 USB2.B7
FIFO_USB_DP: length 19.7
  Top Layer w0.152: USB2.B6 7.13,41.55 8.14,41.55 8.43,41.25 15.98,41.25 18.16,43.43 18.16,46.36 19.15,47.35 20.5,47.35 20.6,47.45 U10.8
FLASH_CS: length 26.1
  Top Layer w0.254: R14.1 56.19,15.29 R15.2 53.84,13.78 53.29,14.33 ; 53.29,14.33 53.29,16.68 52.12,17.86 42.76,17.86 41.41,16.51 39.36,16.51 38.17,17.7 ; 53.29,14.33 51.28,12.32 U9.1
FLASH_SD0: length 7.5
  Top Layer w0.254: U3.53 38.81,15.37 42.54,15.37 43.31,16.13 U9.5
FLASH_SD1: length 20.6
  Top Layer w0.254: U3.55 39.18,16.13 41.53,16.13 42.91,17.5 51.97,17.5 52.93,16.53 52.93,15.22 51.31,13.59 50.9,13.59
FLASH_SD2: length 19.1
  Top Layer w0.254: U9.3 51.69,14.86 52.58,15.75 52.58,16.38 51.82,17.15 43.05,17.15 41.66,15.75 38.99,15.75 37.6,17.14
FLASH_SD3: length 8.2
  Top Layer w0.254: U3.51 38.44,14.61 41.91,14.61 42.93,13.59 43.84,13.59
RPI_USB_DM: length 43.8
  Top Layer w0.152: 75.44,13.53 74.54,12.63 USB1.B7 ; R1.2 37.08,10.15 37.39,9.84 v1(37.39,9.4)
  Bottom Layer w0.152: USB1.B7 74.75,11.92 74.75,11 73.87,10.12 72.17,10.12 71.34,10.95 37.96,10.95 37.64,10.63 37.64,10.21 37.39,9.96 v1(37.39,9.4)
RPI_USB_DP: length 43.8
  Top Layer w0.152: R2.2 38.61,10.15 38.3,9.84 v1(38.3,9.4)
  Bottom Layer w0.152: 74.54,13.53 75.44,12.63 USB1.B6 75.06,11.74 75.06,10.78 74.09,9.81 71.97,9.81 71.14,10.64 38.23,10.64 38.05,10.47 38.05,10.21 38.3,9.96 v1(38.3,9.4)
USB_VBUS: length 19.5
  Top Layer w0.254: 72.69,13.53 72.63,13.53 72,12.9 71.48,12.9 71.12,13.27 71.12,14.99 69.53,16.58 ; 68.07,13.04 68.07,15.23 v1(69.53,16.69)
  Top Layer w0.508: v1(69.53,16.69) 69.53,18.65 R28.1
  Inner2 w0.254: 73.38,12.9 72.75,13.53 72.69,13.53 ; 73.38,12.9 76.66,12.9 ; 73.38,12.9 72.69,12.21 USB1.B9 ; 76.66,12.9 77.29,12.27 USB1.B4 ; 76.66,12.9 77.29,13.53
USB_VBUS2: length 112.1
  Top Layer w0.254: v1(68.07,8.64) 68.07,10.08
  Inner2 w0.254: 7.63,43.4 7.02,42.78 7,42.78 ; 7,39.43 7,39.64 7.38,40.02 7.89,40.02 8.52,40.64 10.03,40.64 10.29,40.39 10.29,32.39 8.89,32.39 4.06,37.21 4.06,40.27 5.97,42.18 6.81,42.18 7,42.36 7,42.78 ; 7,39.43 6.38,38.8 USB2.B4 ; 7,39.43 7.63,38.8 ; USB2.B9 6.39,43.4 7,42.78
  Inner2 w0.508: v1(68.07,8.64) 66.7,7.26 17.25,7.26 ; 17.12,7.26 11.05,13.34 11.05,31.62 10.29,32.39
$1N1: length 2.6
  Top Layer w0.254: C1.1 51.04,55.7 U1.22
$1N150: length 2.5
  Top Layer w0.254: R6.2 71.85,61.23 U5.5
$1N155: length 2.9
  Top Layer w0.254: R7.2 74.39,62.25 U5.7
$1N156: length 3
  Top Layer w0.254: 69.42,40.6 71.11,38.91 U7.7
$1N157: length 2.9
  Top Layer w0.254: U6.7 63.85,38.97 R9.2
$1N160: length 2.5
  Top Layer w0.254: U6.5 66.39,39.98 R8.2
$1N161: length 2.5
  Top Layer w0.254: R10.2 73.65,39.97 U7.5
$1N164: length 2.5
  Top Layer w0.254: U8.5 81.5,39.98 R12.2
$1N182: length 2.9
  Top Layer w0.254: U8.7 78.96,38.97 R13.2
$1N190: length 5
  Top Layer w0.254: 37.7,59.44 37.7,59.3 38.53,58.47 38.53,58.12 39,57.65 U1.4
$1N248: length 5.1
  Top Layer w0.254: R22.1 37.34,48.01 37.87,47.47 38.12,47.47 39.24,46.36 40.54,46.36 40.8,46.09 U2.4
$1N259: length 8.7
  Top Layer w0.254: 56.25,43.56 55.36,42.67 53.97,42.67 53.69,42.96 50.98,42.96 49.8,44.14 U2.22
$1N274: length 4
  Top Layer w0.254: U1.7 38.37,55.7 38.27,55.79 38.03,55.79 RN1.8
$1N277: length 4.7
  Top Layer w0.254: RN2.5 38.03,49.87 38.27,49.87 38.44,50.03 38.44,50.28 39.3,51.15 U1.14
$1N278: length 4.6
  Top Layer w0.254: U1.13 39.15,51.8 38.79,51.44 38.79,51.41 38.44,51.06 38.44,50.83 38.27,50.67 38.03,50.67 RN2.6
$1N279: length 4.6
  Top Layer w0.254: RN2.7 37.95,51.4 38.27,51.4 38.44,51.56 38.44,51.88 39,52.45 U1.12
$1N280: length 4.3
  Top Layer w0.254: U1.11 38.85,53.1 RN2.8
$1N281: length 3.9
  Top Layer w0.254: RN1.5 39.22,53.66 39.3,53.75 U1.10
$1N282: length 3.9
  Top Layer w0.254: U1.9 39.82,54.4 39.76,54.46 RN1.6
$1N283: length 4
  Top Layer w0.254: RN1.7 40.03,55.26 40.24,55.05 41.63,55.05
$1N294: length 4.1
  Top Layer w0.254: RN3.8 39.87,44.63 40.37,44.14 U2.7
$1N295: length 4
  Top Layer w0.254: U2.8 40.04,43.49 39.69,43.83 RN3.7
$1N296: length 3.9
  Top Layer w0.254: RN3.6 39.51,43.03 39.71,42.84 U2.9
$1N297: length 3.9
  Top Layer w0.254: U2.10 39.37,42.19 39.33,42.23 RN3.5
$1N302: length 4.5
  Top Layer w0.254: U2.14 40.64,39.59 39.22,38.17 RN4.5
$1N303: length 4.4
  Top Layer w0.254: RN4.6 38.95,38.97 40.22,40.24 U2.13
$1N304: length 4.3
  Top Layer w0.254: RN4.7 38.68,39.77 39.8,40.89 U2.12
$1N305: length 4.3
  Top Layer w0.254: U2.11 39.38,41.54 38.41,40.57 RN4.8
$1N316: length 7
  Top Layer w0.254: U1.26 49.67,58.3 50.32,58.96 50.32,59.63 50.49,59.8 54.47,59.8 R16.2
$1N317: length 6.4
  Top Layer w0.254: R24.2 54.35,58.17 50.55,58.17 49.38,57 U1.24
$1N321: length 8.9
  Top Layer w0.254: U2.26 52.91,46.74 53.34,47.17 53.34,49.66 54.23,50.55 R23.2
$1N322: length 2.6
  Top Layer w0.254: C39.1 48.57,45.47 U2.24
$2N66: length 6.5
  Top Layer w0.254: U3.13 35.33,22.83 35.33,26.38 RN7.6
$2N67: length 6.3
  Top Layer w0.254: U3.12 35.73,22.66 35.73,25.64 RN7.7
$2N68: length 6.2
  Top Layer w0.254: RN7.8 36.13,24.91 36.13,22.49 U3.11
$2N73: length 4.5
  Top Layer w0.203: 35.63,15.16 36.87,13.92 37.5,13.92 38.1,13.32 38.1,12.83 38.61,12.32 R2.1
$2N75: length 4.2
  Top Layer w0.203: U3.46 36.65,13.56 37.35,13.56 37.72,13.2 37.72,12.95 R1.1
$2N79: length 45.2
  Top Layer w0.254: U3.23 30.2,21.15 28.17,21.15 26.21,19.18 25.02,19.18 C26.1 25.66,20.02 v1(25.74,19.94) ; U3.45 36.19,13.46 36.19,10.6 C28.1 35.5,9.78 v1(36.27,9.01) ; U3.50 38.26,14.22 39.5,14.22 40.19,13.53 C27.1 40.89,12.64 v1(40.89,12.33)
  Inner2 w0.508: 37.86,12.33 35.71,14.48 31.2,14.48 v1(25.74,19.94) ; 37.86,12.33 36.27,10.74 v1(36.27,9.01) ; 37.86,12.33 v1(40.89,12.33)
$2N98: length 5.1
  Top Layer w0.254: SW1.2 54.87,11.87 C53.2 56.19,13.58 R15.1
$2N103: length 9.4
  Top Layer w0.254: 26.72,27.8 26.72,27.41 26.72,27.4 26.72,26.41 27.74,25.39 28.73,25.39 29.22,24.91 29.22,23.82 U3.20
$2N104: length 7
  Top Layer w0.254: U3.21 28.87,23.61 C37.2 26.63,25.04 26.37,25.04
$2N123: length 4.5
  Top Layer w0.254: C54.2 16,17.72 SW2.2 17.77,15.11 R18.1
$2N125: length 14.1
  Top Layer w0.254: R18.2 20.95,16.63 22.35,18.03 26.6,18.03 28.64,20.07 29.58,20.07 U3.26
$2N126: length 15.8
  Top Layer w0.254: 30.78,20 29.99,20.79 28.32,20.79 26.33,18.8 22.61,18.8 20.83,20.57 20.83,22.72 R19.2
$2N127: length 14.4
  Top Layer w0.254: U3.25 29.79,20.43 28.46,20.43 26.47,18.43 22.46,18.43 20.45,20.45 20.45,21.58 R20.2
$2N128: length 3.3
  Top Layer w0.254: R20.1 17.27,22.48 H3.1
$2N129: length 3.3
  Top Layer w0.254: H3.3 17.27,24 R19.1
$2N146: length 6.7
  Top Layer w0.254: U3.14 34.93,22.99 34.93,27.11 RN7.5
$2N149: length 7.2
  Top Layer w0.254: U3.15 32.88,22.99 32.88,23.49 34.54,25.15 34.54,27.86 RN8.8
$2N150: length 7
  Top Layer w0.254: 33.04,22.27 32.48,22.83 32.48,23.65 34.01,25.18 34.01,27.26 RN8.7
$2N151: length 6.6
  Top Layer w0.254: 32.76,21.98 32.08,22.66 32.08,23.82 33.33,25.06 33.33,26.81 RN8.6
$2N152: length 6.2
  Top Layer w0.254: 32.1,26.91 32.64,26.37 32.64,24.94 31.68,23.98 31.68,22.49 32.48,21.7
$2N157: length 5.6
  Top Layer w0.254: RN6.5 39.45,24.25 39.02,24.25 U3.9
$2N158: length 5.8
  Top Layer w0.254: U3.8 38.91,23.57 39.89,23.57 RN6.6
$2N159: length 5.9
  Top Layer w0.254: RN6.7 40.34,22.89 38.79,22.89 U3.7
$2N166: length 6.1
  Top Layer w0.254: RN6.8 40.79,22.2 38.67,22.2 U3.6
$2N167: length 6.6
  Top Layer w0.254: RN5.5 41.83,20.8 37.83,20.8 U3.5
$2N168: length 6.8
  Top Layer w0.254: RN5.6 42.56,20.4 38,20.4 U3.4
$2N169: length 7.1
  Top Layer w0.254: RN5.8 44.03,19.6 38.33,19.6 U3.2
$2N170: length 7
  Top Layer w0.254: RN5.7 43.29,20 38.16,20 37.6,19.44
$2N205: length 6
  Top Layer w0.254: U3.30 29.02,16.51 25.96,16.51 RN9.5
$2N206: length 6.2
  Top Layer w0.254: U3.29 28.81,16.87 25.18,16.87 RN9.6
$2N207: length 7.4
  Top Layer w0.254: 23.65,16.47 24.41,17.22 26.86,17.22 28.95,19.31 29.21,19.31 U3.28
$2N208: length 8.2
  Top Layer w0.254: U3.27 29.37,19.71 28.79,19.71 26.7,17.62 23.67,17.62 23.08,17.03
$2N227: length 20.4
  Top Layer w0.254: USB1.0 80.14,14.76 R5.1 ; R5.1 79.76,12.29 79.76,11.43 79.22,10.9 USB1.0 USB1.0 ; R5.1 83,13.71 C64.1
  Bottom Layer w0.254: USB1.0 USB1.0
$2N228: length 5.5
  Top Layer w0.254: U3.37 29.87,13.4 29.87,12.04 RN10.5
$2N229: length 5.3
  Top Layer w0.254: RN10.6 29.18,12.49 29.18,13.28 U3.36
$2N230: length 5.2
  Top Layer w0.254: RN10.7 28.5,12.94 28.5,13.16 U3.35
$2N231: length 5.2
  Top Layer w0.254: U3.34 28.5,13.73 28.16,13.73 RN10.8
$2N246: length 10.4
  Top Layer w0.254: R27.1 24.01,11.81 24.01,13.08 26.67,15.75 29.39,15.75 U3.32
$2N247: length 10.1
  Top Layer w0.254: 30.21,17.14 29.23,16.16 26.45,16.16 22.52,12.22 R26.1
$2N248: length 25.2
  Top Layer w0.254: H2.1 19.81,1.88 20.69,1 27.53,1 31.37,4.83 31.37,12.64 33.04,14.31
$2N249: length 22.1
  Top Layer w0.254: U3.40 30.97,12.8 30.97,4.94 27.43,1.4 23,1.4 22.35,2.04 H2.3
$2N250: length 19
  Top Layer w0.254: 32.48,14.88 30.58,12.98 30.58,11.75 30.57,11.74 30.57,5.04 27.32,1.8 25.31,1.8 24.89,2.21 H2.5
$2N251: length 14.2
  Top Layer w0.254: U3.38 30.22,13.19 30.22,11.89 30.17,11.84 30.17,5.28 28.32,3.43 H2.7
$2N252: length 4.3
  Top Layer w0.254: 27.43,5.97 27.43,7.69 27.3,7.82 27.3,9.47 RN10.4
$2N253: length 5.6
  Top Layer w0.254: RN10.3 24.89,8.2 24.89,5.97
$2N254: length 7.5
  Top Layer w0.254: 22.35,5.97 22.35,7.69 23.47,8.8 23.57,8.8 24.07,9.3 24.86,9.3 RN10.2
$2N260: length 4.8
  Top Layer w0.254: R35.1 75.69,15.74 75.69,14.35 76.34,13.7 USB1.B5
$2N261: length 3.4
  Top Layer w0.254: 73.64,13.53 74.29,14.18 74.29,15.74 R34.1
$2N274: length 34.3
  Top Layer w0.254: 30.97,28.04 29.84,29.16 v1(29.84,29.59)
  Bottom Layer w0.254: v1(29.84,29.59) 33.4,26.04 33.4,22.86 30.99,20.45 30.99,14.99 24.89,8.89 24.89,8.47 24.55,8.13 24.13,8.13 23.88,7.87 21.72,7.87 19.81,5.97
$3N17: length 9.1
  Top Layer w0.254: X2.1 14.1,49.02 15.81,49.02 C50.2 17.55,49.45 U10.4
$3N18: length 6.8
  Top Layer w0.254: X2.3 16.49,47.8 C49.2 17.64,48.95 U10.5
$3N43: length 7.4
  Top Layer w0.254: U10.15 21.8,43.52 21.21,42.93 20.7,42.93 20.07,42.3 R30.1 19.94,41.39 U11.6
$3N44: length 12
  Top Layer w0.254: U10.16 22.3,43.44 21.43,42.57 21.16,42.57 20.76,42.17 20.76,39.8 R31.1 21.21,39.25 U11.5 21.21,34.92 22.73,33.4
$3N76: length 1.6
  Top Layer w0.254: R32.2 27.8,52.81 U10.44
$3N81: length 2.8
  Top Layer w0.254: R3.2 17.4,29.6 U11.1
$3N84: length 22.6
  Top Layer w0.254: U10.42 29.23,50.95 29.46,51.18 v1(29.46,51.94) ; 20.76,57.28 20.76,59.93 SW3.1 20.64,59.94 R4.2 v1(17.53,59.94)
  Bottom Layer w0.254: v1(29.46,51.94) 21.47,59.94 v1(17.53,59.94)
$3N113: length 19.8
  Top Layer w0.254: USB2.0 5,37.35 R25.1 ; C65.1 7.4,33.12 R25.1 ; R25.1 8.86,36.41 USB2.0
  Bottom Layer w0.254: USB2.0 USB2.0 ; USB2.0 USB2.0
$3N117: length 4.9
  Top Layer w0.254: R29.1 4.07,41.78 5.58,41.78 5.97,42.18 7.36,42.18 7.63,42.45
$3N118: length 3.5
  Top Layer w0.254: USB2.B5 5.59,40.39 3.95,40.39 R33.2
$3N119: length 3.1
  Top Layer w0.254: 30.62,47.88 30.44,48.06 30.37,48.06 30.02,48.4 30.02,48.46 29.87,48.62 ; U10.37 29.7,48.45 29.87,48.62 ; 29.87,48.62 29.54,48.95 U10.38

## Copper pours and planes (outline as drawn; the poured copper is in the pictures)
AGND on Top Layer: -4.19,93.85 106.93,93.85 106.93,-8.76 -4.19,-8.76
AGND on Bottom Layer: -8.13,90.93 103,90.93 103,-10.67 -8.13,-10.67
AGND on Inner1: 0.26,88.64 98.8,88.64 98.8,0.26 0.26,0.26
AGND on Inner2: -5.42,92.76 105.7,92.76 105.7,-9.85 -5.42,-9.85

Small or netless copper shapes (teardrops, artwork), in the pictures only: 647 on Top Layer, 41 on Bottom Layer, 64 on Inner1, 78 on Inner2

## Text on the board
Bottom Silkscreen Layer: Meet AOI ! | E | R
Top Silkscreen Layer: Project PRISM / Feb 01 2026
